# Altium schematic sheet wzy_SCH1.SchDoc
size A3
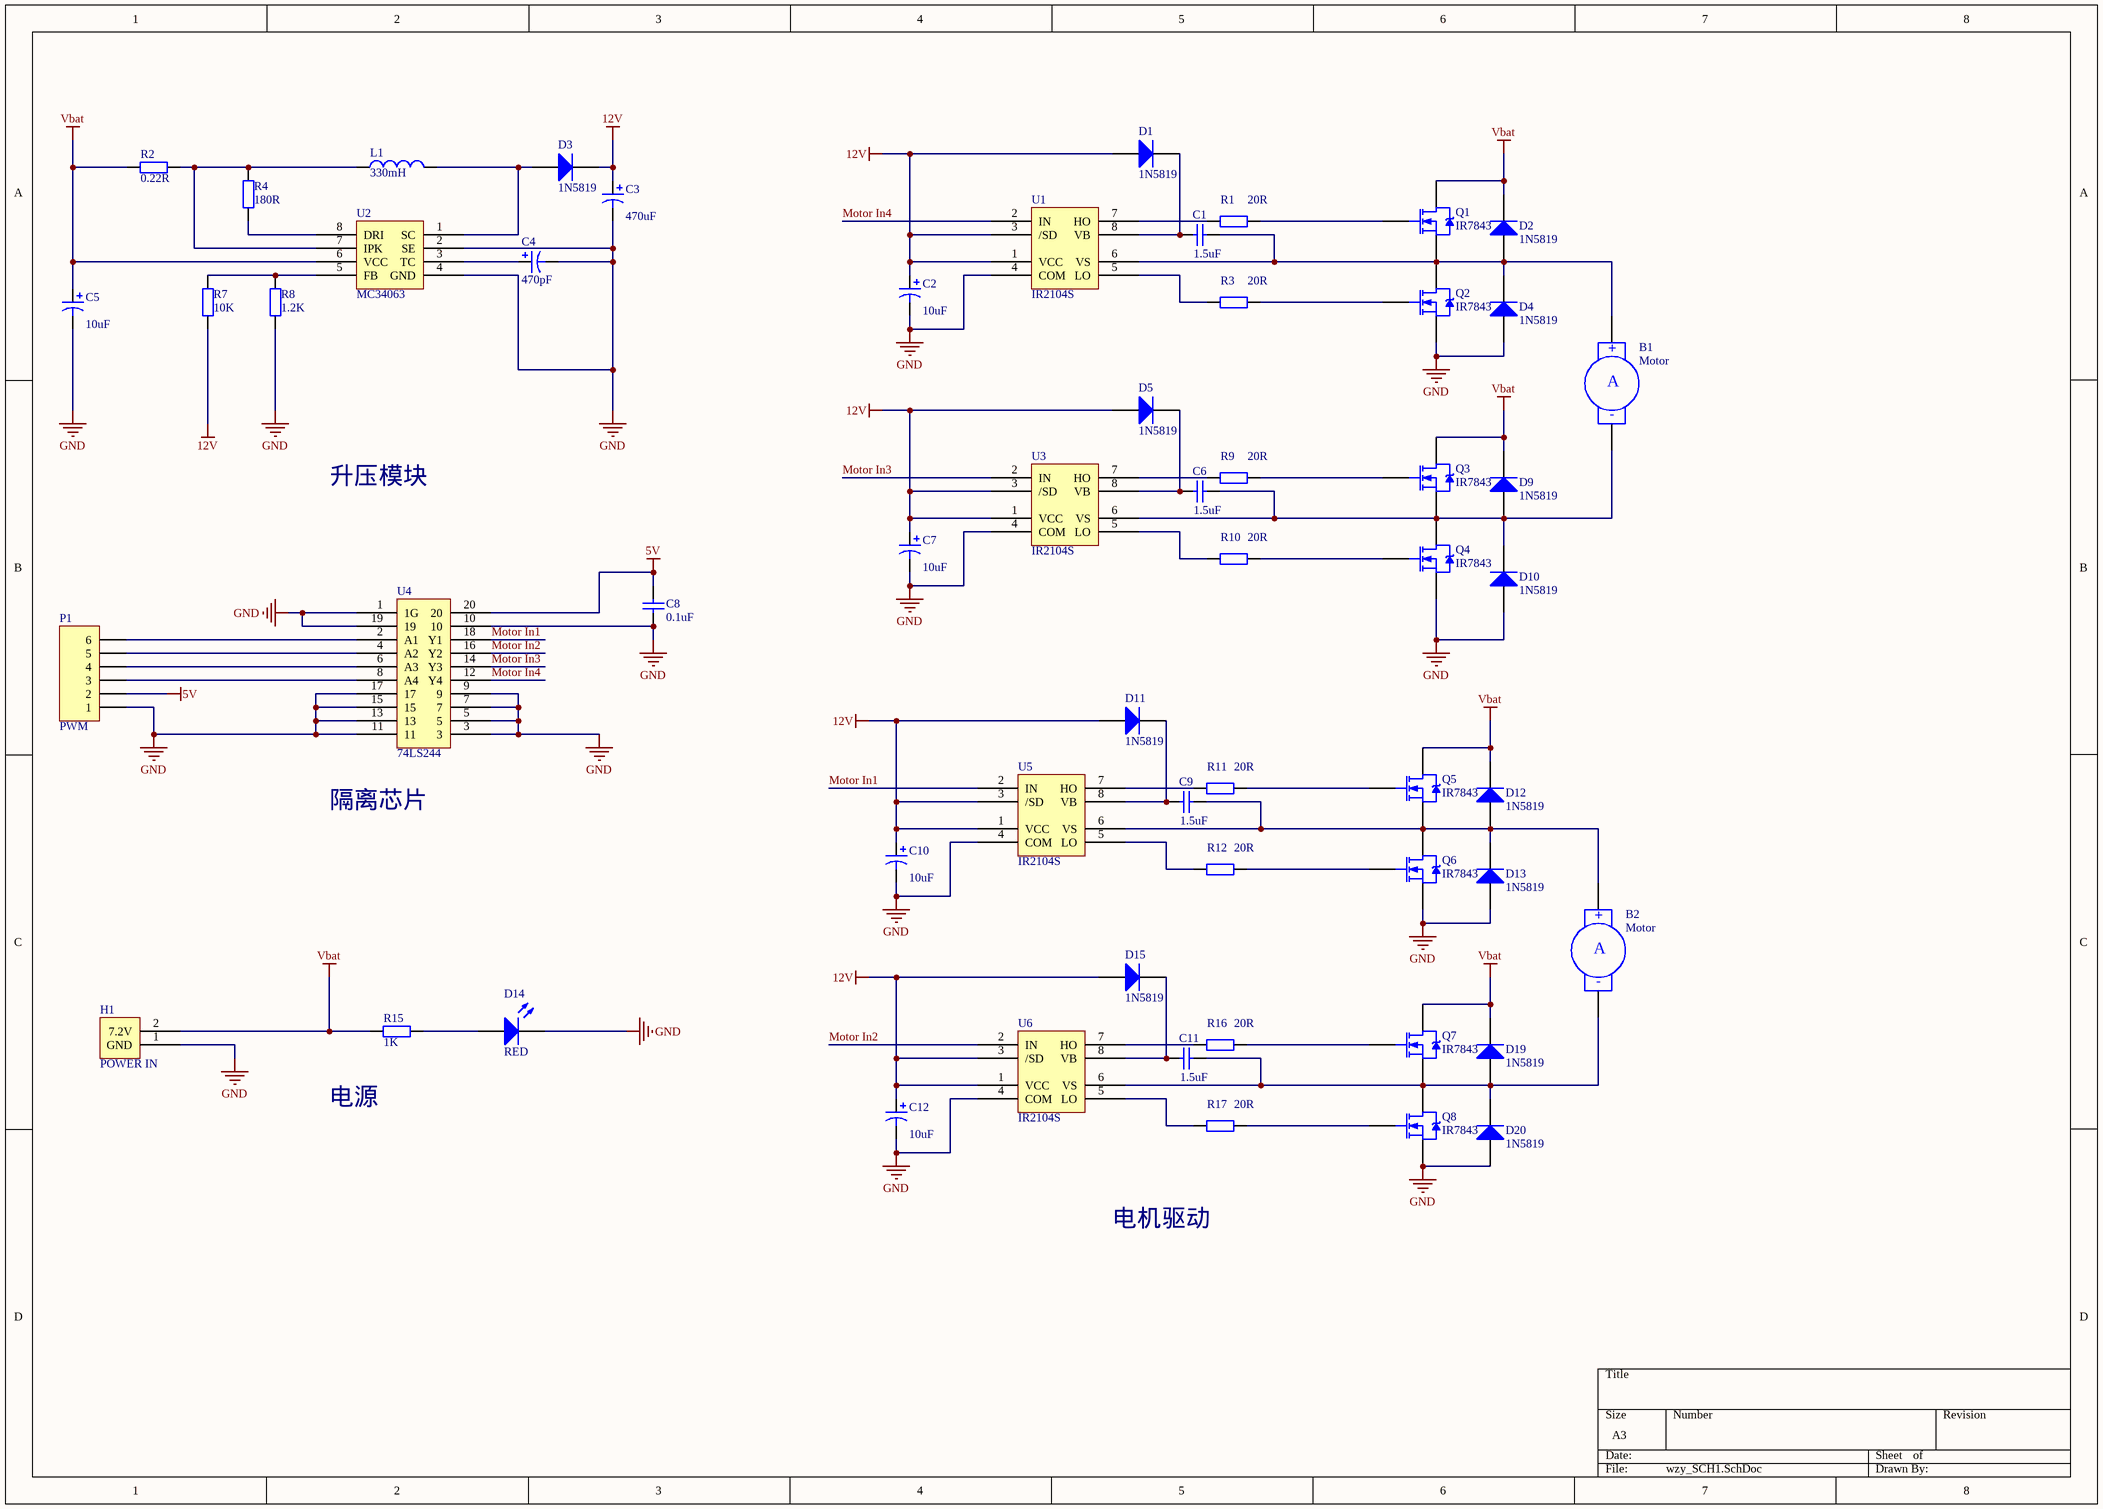
[diagram p0: wzy_SCH1.SchDoc]

## Parts
B1  Motor  [KF301-2P]
B2  Motor  [KF301-2P]
C1  value 1.5uF  [0805(2012)]  (hidden comment: Cap)
C2  value 10uF  [SOD-323(0805)]  (hidden comment: Cap Pol1)
C3  value 470uF  [RB5-10.5]  (hidden comment: Cap Pol1)
C4  value 470pF  [SOD-323(0805)]  (hidden comment: Cap Pol1)
C5  value 10uF  [SOD-323(0805)]  (hidden comment: Cap Pol1)
C6  value 1.5uF  [0805(2012)]  (hidden comment: Cap)
C7  value 10uF  [SOD-323(0805)]  (hidden comment: Cap Pol1)
C8  value 0.1uF  [0805(2012)]  (hidden comment: Cap)
C9  value 1.5uF  [0805(2012)]  (hidden comment: Cap)
C10  value 10uF  [SOD-323(0805)]  (hidden comment: Cap Pol1)
C11  value 1.5uF  [0805(2012)]  (hidden comment: Cap)
C12  value 10uF  [SOD-323(0805)]  (hidden comment: Cap Pol1)
D1  1N5819  [0805(2012)]
D2  1N5819  [0805(2012)]
D3  1N5819  [0805(2012)]
D4  1N5819  [0805(2012)]
D5  1N5819  [0805(2012)]
D9  1N5819  [0805(2012)]
D10  1N5819  [0805(2012)]
D11  1N5819  [0805(2012)]
D12  1N5819  [0805(2012)]
D13  1N5819  [0805(2012)]
D14  RED  [0805LED]
D15  1N5819  [0805(2012)]
D19  1N5819  [0805(2012)]
D20  1N5819  [0805(2012)]
H1  POWER IN  [KF301-2P]
L1  value 330mH  [电感10*12]  (hidden comment: Inductor)
P1  PWM  [HDR1X6]
Q1  IR7843  [LR7843]
Q2  IR7843  [LR7843]
Q3  IR7843  [LR7843]
Q4  IR7843  [LR7843]
Q5  IR7843  [LR7843]
Q6  IR7843  [LR7843]
Q7  IR7843  [LR7843]
Q8  IR7843  [LR7843]
R1  value 20R  [0805(2012)]  (hidden comment: Res2)
R2  value 0.22R  [1206(3216)]  (hidden comment: Res2)
R3  value 20R  [0805(2012)]  (hidden comment: Res2)
R4  value 180R  [0805(2012)]  (hidden comment: Res2)
R7  value 10K  [0805(2012)]  (hidden comment: Res2)
R8  value 1.2K  [0805(2012)]  (hidden comment: Res2)
R9  value 20R  [0805(2012)]  (hidden comment: Res2)
R10  value 20R  [0805(2012)]  (hidden comment: Res2)
R11  value 20R  [0805(2012)]  (hidden comment: Res2)
R12  value 20R  [0805(2012)]  (hidden comment: Res2)
R15  value 1K  [0805(2012)]  (hidden comment: Res2)
R16  value 20R  [0805(2012)]  (hidden comment: Res2)
R17  value 20R  [0805(2012)]  (hidden comment: Res2)
U1  IR2104S  [IR2104S]
U2  MC34063  [MC34063]
U3  IR2104S  [IR2104S]
U4  74LS244  [74ls244DA]
U5  IR2104S  [IR2104S]
U6  IR2104S  [IR2104S]

## Nets
5V: C8.2 P1.2 U4.20
12V: C2.1 C3.1 C7.1 C10.1 C12.1 D1.2(A) D3.1(K) D5.2(A) D11.2(A) D15.2(A) R7.1 U1.1(VCC) U1.3(/SD) U3.1(VCC) U3.3(/SD) U5.1(VCC) U5.3(/SD) U6.1(VCC) U6.3(/SD)
GND: C2.2 C3.2 C4.2 C5.2 C7.2 C8.1 C10.2 C12.2 D4.2(A) D10.2(A) D13.2(A) D14.2(K) D20.2(A) H1.1(GND) P1.1 Q2.3(S) Q4.3(S) Q6.3(S) Q8.3(S) R8.1 U1.4(COM) U2.2(SE) U2.4(GND) U3.4(COM) U4.1(1G) U4.3 U4.5 U4.7 U4.9 U4.10 U4.11 U4.13 U4.15 U4.17 U4.19 U5.4(COM) U6.4(COM)
Vbat: C5.1 D2.1(K) D9.1(K) D12.1(K) D19.1(K) H1.2(7.2V) Q1.2(D) Q3.2(D) Q5.2(D) Q7.2(D) R2.2 R15.1 U2.6(VCC)
Motor In1: U4.18(Y1) U5.2(IN)
Motor In2: U4.16(Y2) U6.2(IN)
Motor In3: U3.2(IN) U4.14(Y3)
Motor In4: U1.2(IN) U4.12(Y4)
NetB1_1: B1.1(+) C1.2 D2.2(A) D4.1(K) Q1.3(S) Q2.2(D) U1.6(VS)
NetB1_2: B1.2(-) C6.2 D9.2(A) D10.1(K) Q3.3(S) Q4.2(D) U3.6(VS)
NetB2_1: B2.1(+) C9.2 D12.2(A) D13.1(K) Q5.3(S) Q6.2(D) U5.6(VS)
NetB2_2: B2.2(-) C11.2 D19.2(A) D20.1(K) Q7.3(S) Q8.2(D) U6.6(VS)
NetC1_1: C1.1 D1.1(K) U1.8(VB)
NetC4_1: C4.1 U2.3(TC)
NetC6_1: C6.1 D5.1(K) U3.8(VB)
NetC9_1: C9.1 D11.1(K) U5.8(VB)
NetC11_1: C11.1 D15.1(K) U6.8(VB)
NetD3_2: D3.2(A) L1.2 U2.1(SC)
NetD14_1: D14.1(A) R15.2
NetL1_1: L1.1 R2.1 R4.2 U2.7(IPK)
NetP1_3: P1.3 U4.8(A4)
NetP1_4: P1.4 U4.6(A3)
NetP1_5: P1.5 U4.4(A2)
NetP1_6: P1.6 U4.2(A1)
NetQ1_1: Q1.1(G) R1.2
NetQ2_1: Q2.1(G) R3.2
NetQ3_1: Q3.1(G) R9.2
NetQ4_1: Q4.1(G) R10.2
NetQ5_1: Q5.1(G) R11.2
NetQ6_1: Q6.1(G) R12.2
NetQ7_1: Q7.1(G) R16.2
NetQ8_1: Q8.1(G) R17.2
NetR1_1: R1.1 U1.7(HO)
NetR3_1: R3.1 U1.5(LO)
NetR4_1: R4.1 U2.8(DRI)
NetR7_2: R7.2 R8.2 U2.5(FB)
NetR9_1: R9.1 U3.7(HO)
NetR10_1: R10.1 U3.5(LO)
NetR11_1: R11.1 U5.7(HO)
NetR12_1: R12.1 U5.5(LO)
NetR16_1: R16.1 U6.7(HO)
NetR17_1: R17.1 U6.5(LO)

## Notes on the sheet
- 升压模块
- 隔离芯片
- 电源
- 电机驱动
- (in symbol Motor Servo) A

## Library data of the parts
B1 B2 = Motor Servo: Servo Motor; Published: 24-Mar-1999; LatestRevisionDate: 17-Jul-2002; LatestRevisionNote: Re-released for DXP Platform.; PackageReference: RAD-0.4; Publisher: Altium Limited; PackageDescription: Radial Cap, Thru-Hole; 2 Leads; 0.4 in Pin Spacing
C1 C6 C8 C9 C11 = Cap: Capacitor; Published: 8-Jun-2000; LatestRevisionDate: 17-Jul-2002; LatestRevisionNote: Re-released for DXP Platform.; PackageReference: RAD-0.3; Publisher: Altium Limited; PackageDescription: Radial Cap, Thru-Hole; 2 Leads; 0.3 in Pin Spacing
C2-C5 C7 C10 C12 = Cap Pol1: Polarized Capacitor (Radial); Published: 8-Jun-2000; LatestRevisionDate: 17-Jul-2002; LatestRevisionNote: Re-released for DXP Platform.; PackageReference: RB7.6-15; Publisher: Altium Limited; PackageDescription: Polarized Capacitor (Radial); 2 Leads
D1-D5 D9-D13 D15 D19 D20 = 1N4148: Silicon Epitaxial Planar Diode for Various Detector, Modulator, Demodulator; Published: 12-Feb-2010; DatasheetVersion: Rev.5.00, Jul-2006; PackageVersion: Aug-2005; PackageReference: GRZZ0002ZB-A; Publisher: Altium Limited; PackageDescription: Diode, Axial; Body 4.2 x 2.0 mm (LxDia.), Lead Dia. 0.5 mm (nom); Code_JEITA: SC-40; ComponentLink1Description: Manufacturer Link; ComponentLink1URL: http://sg.renesas.com/fmwk.jsp?cnt=diode_landing.jsp&fp=/products/discrete/diodes/; ComponentLink2Description: Datasheet; ComponentLink2URL: http://documentation.renesas.com/eng/products/diode/rej03g0556_1n4148.pdf; ComponentLink3Description: Packaging Specification; ComponentLink3URL: http://sg.renesas.com/media/products/common_info/package/pdf/diode/code/grzz0002zb_a.pdf
D14 = LED2: Typical RED, GREEN, YELLOW, AMBER GaAs LED; Published: 8-Jun-2000; LatestRevisionDate: 17-Jul-2002; LatestRevisionNote: Re-released for DXP Platform.; PackageVersion: Feb-2002; PackageReference: 3.2X1.6X1.1; Publisher: Altium Limited; PackageDescription: SM LED; 2 Flat Leads
L1 = Inductor: Code_IEC: 1005; Published: 8-Jun-2000; LatestRevisionDate: 29-May-2009; LatestRevisionNote: IPC-7351 Footprint Added.; PackageReference: 0402-A; Publisher: Altium Limited; PackageDescription: Chip Inductor; Code_JEITA: 0402
P1 = Header 6: Header, 6-Pin; LatestRevisionDate: 17-Jul-2002; LatestRevisionNote: Re-released for DXP Platform.; Publisher: Altium Limited
Q1-Q8 = IR7843: N-Channel Power MOSFET; Note: Pin 2 is electrically connected to pin 4.; Published: 8-Jun-2000; LatestRevisionDate: 17-Jul-2002; LatestRevisionNote: Re-released for DXP Platform.; DatasheetVersion: PD-9.814; PackageVersion: Feb-1997; PackageReference: TO-220AB; Publisher: Altium Limited; PackageDescription: TO, Thru-Hole, Vertical, Heatsink Mounted; 3 In-Line Leads; Pitch 2.54 mm; ComponentLink1Description: Manufacturer Link; ComponentLink1URL: http://www.irf.com/
R1-R4 R7-R12 R15-R17 = Res2: Resistor; Published: 8-Jun-2000; LatestRevisionDate: 17-Jul-2002; LatestRevisionNote: Re-released for DXP Platform.; PackageReference: AXIAL-0.4; Publisher: Altium Limited; PackageDescription: Axial Device, Thru-Hole; 2 Leads; 0.4 in Pin Spacing